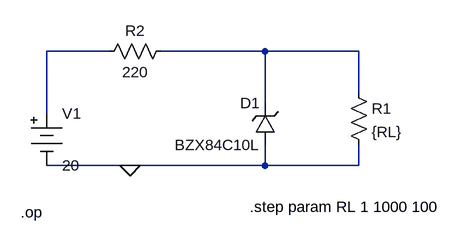
[diagram p0: schematic EXP-2_LoadRegulator.asc]
EXP-2_LoadRegulator.asc, the LTspice schematic file:
Version 4
SHEET 1 880 680
WIRE 160 32 64 32
WIRE 400 32 240 32
WIRE 544 32 400 32
WIRE 544 96 544 32
WIRE 400 112 400 32
WIRE 64 128 64 32
WIRE 192 208 64 208
WIRE 400 208 400 176
WIRE 400 208 192 208
WIRE 544 208 544 176
WIRE 544 208 400 208
FLAG 192 208 0
SYMBOL Misc\\battery 64 112 R0
WINDOW 123 0 0 Left 0
WINDOW 39 0 0 Left 0
SYMATTR InstName V1
SYMATTR Value 20
SYMBOL zener 416 176 R180
WINDOW 0 24 64 Left 2
WINDOW 3 24 0 Left 2
SYMATTR InstName D1
SYMATTR Value BZX84C10L
SYMBOL res 528 80 R0
SYMATTR InstName R1
SYMATTR Value {RL}
SYMBOL res 256 16 R90
WINDOW 0 0 56 VBottom 2
WINDOW 3 32 56 VTop 2
SYMATTR InstName R2
SYMATTR Value 220
TEXT 24 280 Left 2 !.op
TEXT 376 272 Left 2 !.step param RL 1 1000 100

The netlist it stands for:
* EXP-2_LoadRegulator.asc
V1 N001 0 20
D1 0 N002 BZX84C10L
R1 N002 0 {RL}
R2 N002 N001 220
.model D D
.lib standard.dio
.op
.step param RL 1 1000 100
.backanno
.end